# Altium schematic sheet REUN.468349.001_PSU_Board_12B_Interface.SchDoc
size 420 x 297 mm; DocumentNumber: РЕУН.468349.001 Э3 2D; SheetNumber: 7; Format: A3
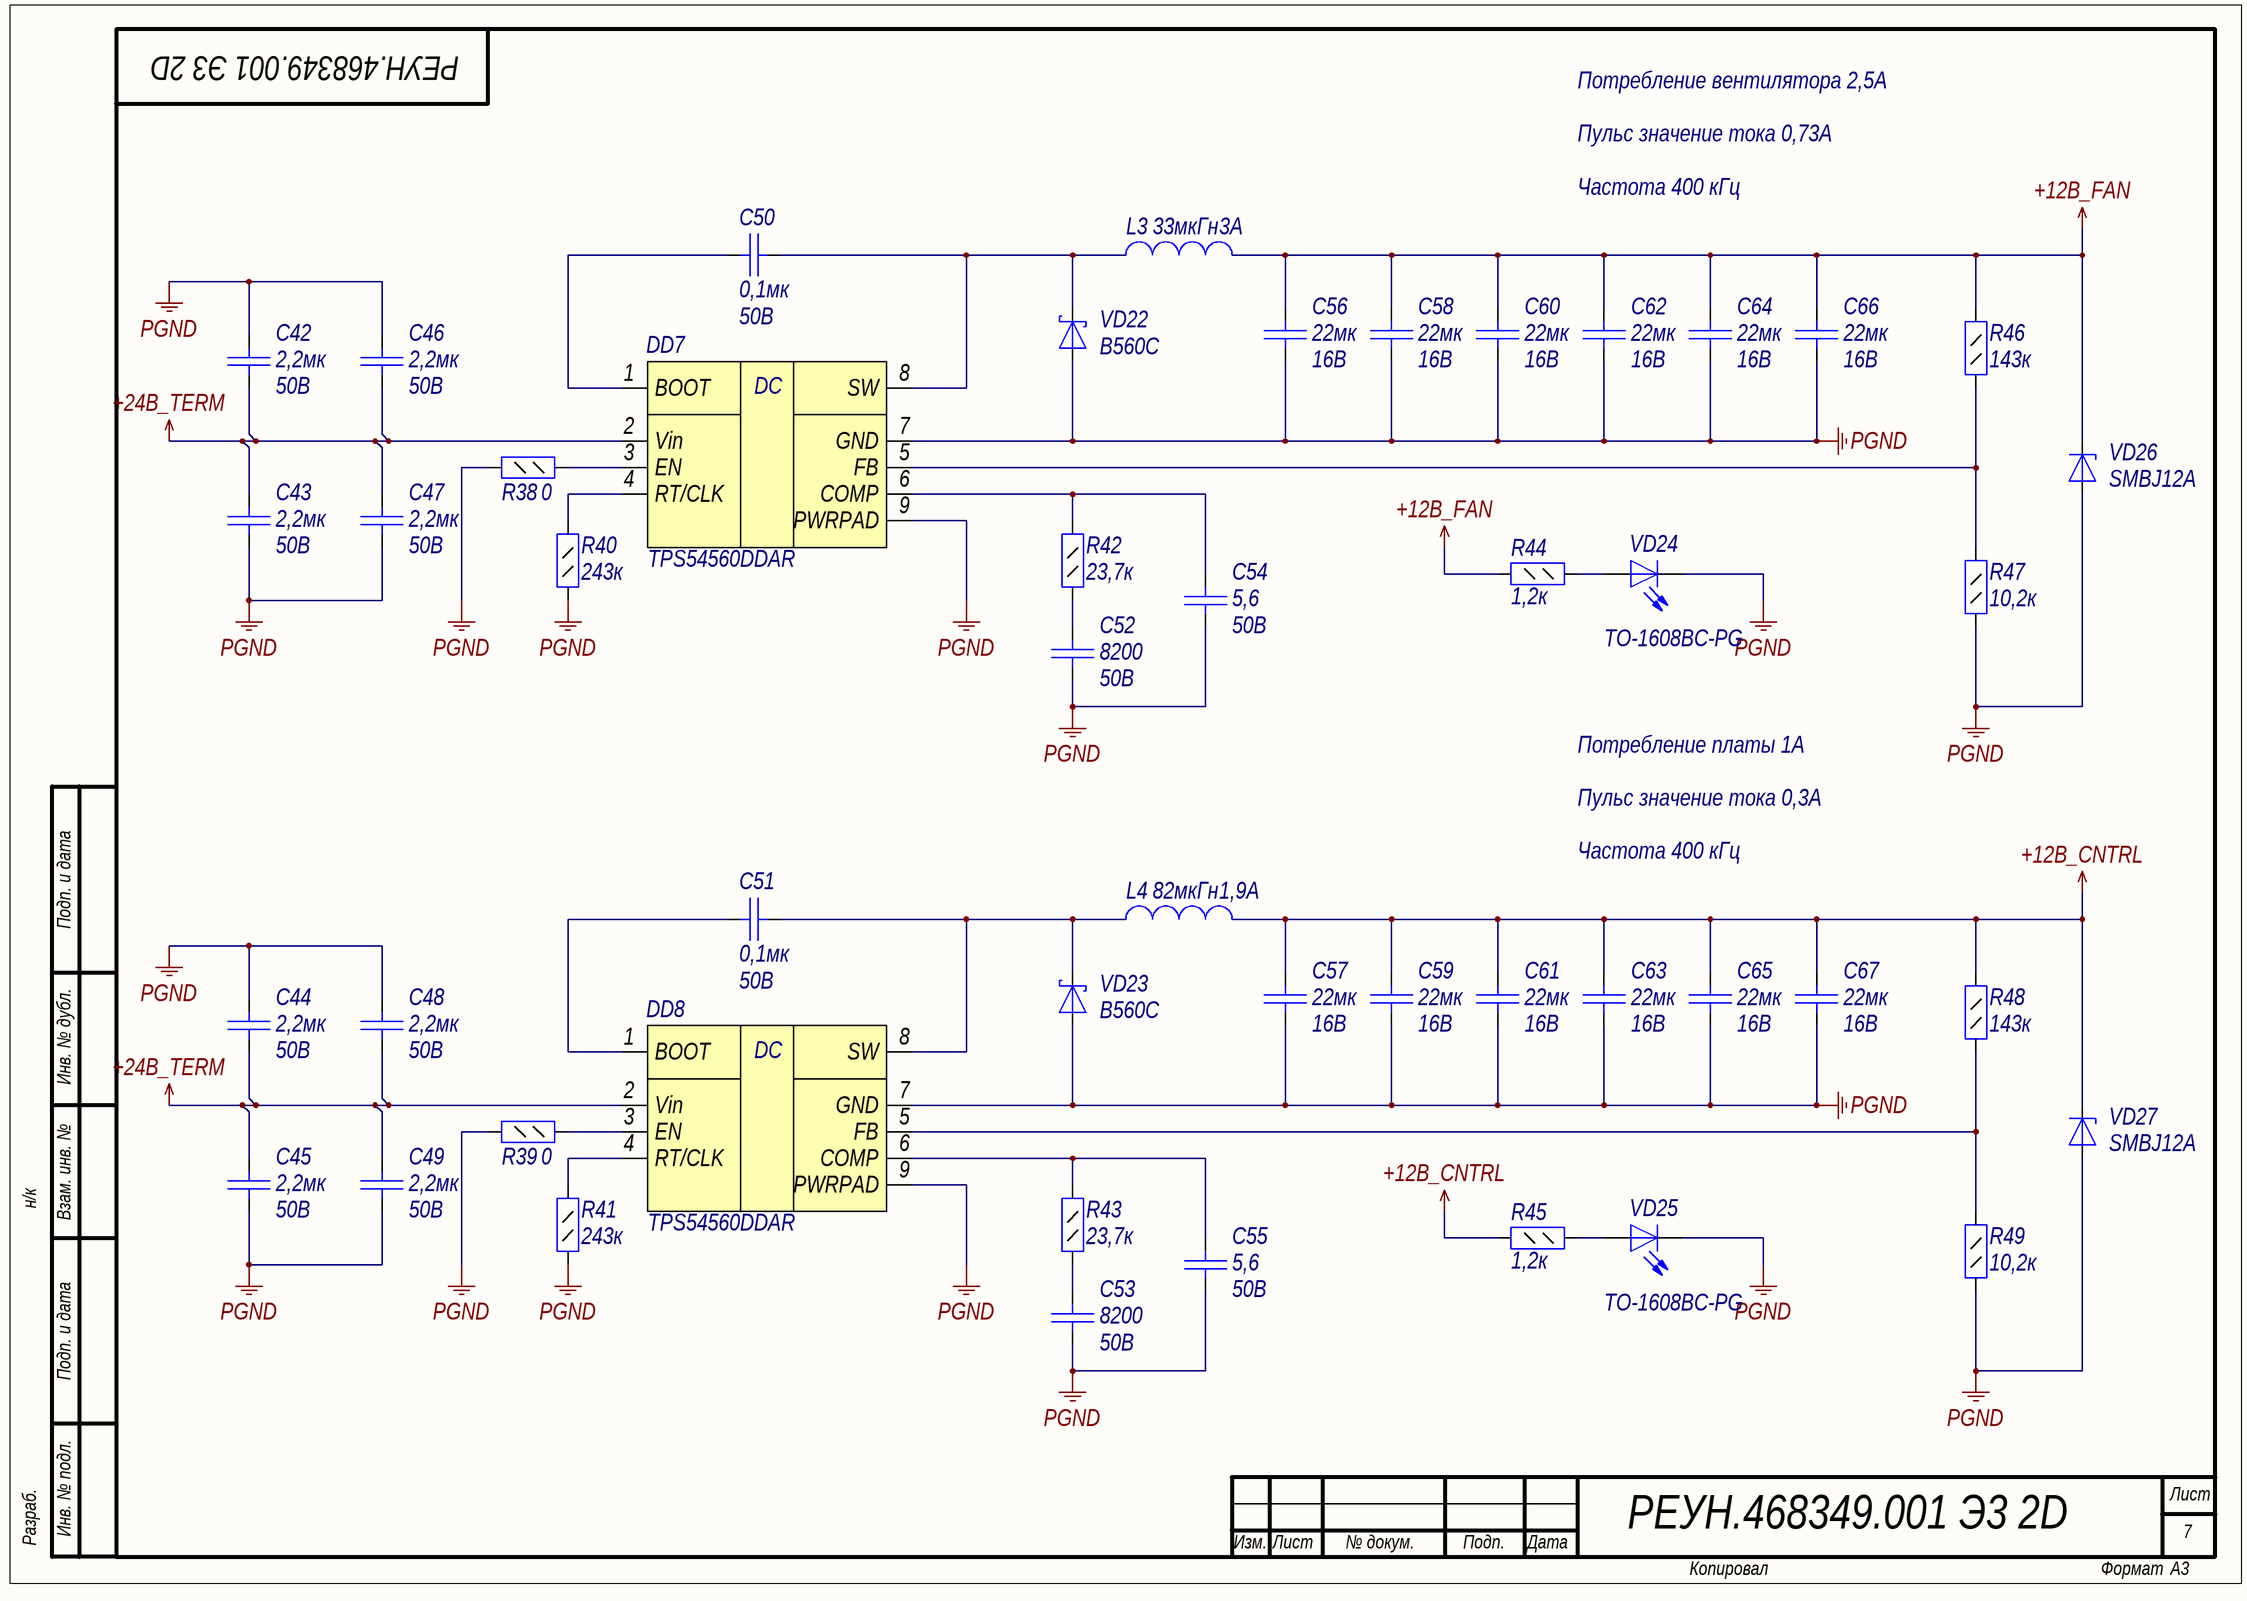
[diagram p0: REUN.468349.001_PSU_Board_12B_Interface.SchDoc]

## Parts
C42  Voltage: 50B  [C1206]  (hidden comment: 2,2мк)
C43  Voltage: 50B  [C1206]  (hidden comment: 2,2мк)
C44  Voltage: 50B  [C1206]  (hidden comment: 2,2мк)
C45  Voltage: 50B  [C1206]  (hidden comment: 2,2мк)
C46  Voltage: 50B  [C1206]  (hidden comment: 2,2мк)
C47  Voltage: 50B  [C1206]  (hidden comment: 2,2мк)
C48  Voltage: 50B  [C1206]  (hidden comment: 2,2мк)
C49  Voltage: 50B  [C1206]  (hidden comment: 2,2мк)
C50  Voltage: 50B  [C0805]  (hidden comment: 0,1мк)
C51  Voltage: 50B  [C0805]  (hidden comment: 0,1мк)
C52  Voltage: 50В  [C0805]  (hidden comment: 8200)
C53  Voltage: 50В  [C0805]  (hidden comment: 8200)
C54  Voltage: 50B  [C0805]  (hidden comment: 5,6)
C55  Voltage: 50B  [C0805]  (hidden comment: 5,6)
C56  Voltage: 16B  [C1210]  (hidden comment: 22мк)
C57  Voltage: 16B  [C1210]  (hidden comment: 22мк)
C58  Voltage: 16B  [C1210]  (hidden comment: 22мк)
C59  Voltage: 16B  [C1210]  (hidden comment: 22мк)
C60  Voltage: 16B  [C1210]  (hidden comment: 22мк)
C61  Voltage: 16B  [C1210]  (hidden comment: 22мк)
C62  Voltage: 16B  [C1210]  (hidden comment: 22мк)
C63  Voltage: 16B  [C1210]  (hidden comment: 22мк)
C64  Voltage: 16B  [C1210]  (hidden comment: 22мк)
C65  Voltage: 16B  [C1210]  (hidden comment: 22мк)
C66  Voltage: 16B  [C1210]  (hidden comment: 22мк)
C67  Voltage: 16B  [C1210]  (hidden comment: 22мк)
DD7  TPS54560DDAR  [SO Powerpad8]
DD8  TPS54560DDAR  [SO Powerpad8]
L3  value 33мкГн  Rated Current: 3A  [IND_12.5x12.5]  (hidden comment: Inductor)
L4  value 82мкГн  Rated Current: 1,9A  [IND_12.5x12.5]  (hidden comment: Inductor)
R38  value 0  [R0805]  (hidden comment: Resistor_0,125Вт)
R39  value 0  [R0805]  (hidden comment: Resistor_0,125Вт)
R40  value 243к  [R0805]  (hidden comment: Resistor_0,125Вт)
R41  value 243к  [R0805]  (hidden comment: Resistor_0,125Вт)
R42  value 23,7к  [R0805]  (hidden comment: Resistor_0,125Вт)
R43  value 23,7к  [R0805]  (hidden comment: Resistor_0,125Вт)
R44  value 1,2к  [R0805]  (hidden comment: Resistor_0,125Вт)
R45  value 1,2к  [R0805]  (hidden comment: Resistor_0,125Вт)
R46  value 143к  [R0805]  (hidden comment: Resistor_0,125Вт)
R47  value 10,2к  [R0805]  (hidden comment: Resistor_0,125Вт)
R48  value 143к  [R0805]  (hidden comment: Resistor_0,125Вт)
R49  value 10,2к  [R0805]  (hidden comment: Resistor_0,125Вт)
VD22  B560C  [SMC]
VD23  B560C  [SMC]
VD24  TO-1608BC-PG  [L_0603_GREEN]
VD25  TO-1608BC-PG  [L_0603_GREEN]
VD26  SMBJ12A  [SMB]
VD27  SMBJ12A  [SMB]

## Nets
+12B_CNTRL: C57.2 C59.2 C61.2 C63.2 C65.2 C67.2 L4.2 R45.2 R48.2 VD27.1(K)
+12B_FAN: C56.2 C58.2 C60.2 C62.2 C64.2 C66.2 L3.2 R44.2 R46.2 VD26.1(K)
+24B_TERM: C42.1 C43.2 C44.1 C45.2 C46.1 C47.2 C48.1 C49.2 DD7.2(Vin) DD8.2(Vin)
PGND: C42.2 C43.1 C44.2 C45.1 C46.2 C47.1 C48.2 C49.1 C52.1 C53.1 C54.1 C55.1 C56.1 C57.1 C58.1 C59.1 C60.1 C61.1 C62.1 C63.1 C64.1 C65.1 C66.1 C67.1 DD7.7(GND) DD7.9(PWRPAD) DD8.7(GND) DD8.9(PWRPAD) R38.2 R39.2 R40.1 R41.1 R47.1 R49.1 VD22.2(A) VD23.2(A) VD24.1(K) VD25.1(K) VD26.2(A) VD27.2(A)
NetC50_1: C50.1 DD7.8(SW) L3.1 VD22.1(K)
NetC50_2: C50.2 DD7.1(BOOT)
NetC51_1: C51.1 DD8.8(SW) L4.1 VD23.1(K)
NetC51_2: C51.2 DD8.1(BOOT)
NetC52_2: C52.2 R42.1
NetC53_2: C53.2 R43.1
NetC54_2: C54.2 DD7.6(COMP) R42.2
NetC55_2: C55.2 DD8.6(COMP) R43.2
NetDD7_3: DD7.3(EN) R38.1
NetDD7_4: DD7.4(RT/CLK) R40.2
NetDD7_5: DD7.5(FB) R46.1 R47.2
NetDD8_3: DD8.3(EN) R39.1
NetDD8_4: DD8.4(RT/CLK) R41.2
NetDD8_5: DD8.5(FB) R48.1 R49.2
NetR44_1: R44.1 VD24.2(A)
NetR45_1: R45.1 VD25.2(A)

## Notes on the sheet
- Потребление вентилятора 2,5А
- Пульс значение тока 0,73А
- Частота 400 кГц
- Потребление платы 1А
- Пульс значение тока 0,3А
- Подп. и дата
- Инв. № дубл.
- н/к
- Взам. инв. №
- Разраб.
- Инв. № подл.
- Лист
- Изм.
- № докум.
- Подп.
- Дата
- Копировал
- Формат
- (in symbol pwr177) DC

## Library data of the parts
C42-C49 = cap351: Конденсатор; Part Name: MLCC; Manufacture: Samsung; Part Number: CL31B225KBHNNNE; id: cap351; TKE: X7R; tga: 0.10%; Value: 2,2мк
C50 C51 = cap141: Конденсатор; Part Name: Ceramic; Manufacture: Murata; Part Number: GRM21BR71H104KA01K; id: cap141; TKE: X7R; Value: 0,1мк
C52 C53 = cap171: Конденсатор; Part Name: Ceramic; Manufacture: Murata; Part Number: GRM216R71H822KA01D; id: cap171; TKE: X7R; Value: 8200
C54 C55 = cap355: Конденсатор; Part Name: Ceramic; Manufacture: Samsung; Part Number: CL21C5R6CBANNNC; id: cap355; TKE: NP0; tga: 0.05%; Value: 5,6
C56-C67 = cap352: Конденсатор; Part Name: MLCC; Manufacture: Samsung; Part Number: CL32B226KOJNNNE; id: cap352; TKE: X7R; tga: 0.10%; Value: 22мк
DD7 DD8 = pwr177: 5-A, Wide Input Range, Step-Down Converter; Part Name: Step Down DC-DC Converter with Eco-mode; Manufacturer: Texas Instruments; id: pwr177; Input Voltage: 4,5-60В; Output Voltage: 0,8B-58,8B; Current: 5A; Frequency: 100 kHz-25 MHz; Type: Impulse; Part Number: TPS54560DDAR
L3 = ind80: EMI Suppression Filter; Part Name: SMD Power Inductors; Part Number: B82477G4333M000; Manufacture: Epcos; id: ind80; Saturation Current: 3,5A; Resistance: 0,053Ohm
L4 = ind83: EMI Suppression Filter; Part Name: SMD Power Inductors; Part Number: B82477G4823M000; Manufacture: Epcos; id: ind83; Saturation Current: 2,25A; Resistance: 0,145Ohm
R38 R39 = res25: Резистор; Manufacture: Yageo; Part Number: RC0805FR-070RL; id: res49; Accuracy: 0.01; Part Name: Resistor; Power: 0,125Вт
R40 R41 = res1226: Резистор; Manufacture: Yageo; Part Number: RC0805FR-07243KL; Accuracy: 0.01; id: res1226; Part Name: Resistor; Power: 0,125Вт
R42 R43 = res1173: Резистор; Manufacture: Yageo; Part Number: RC0805FR-0723K7L; Accuracy: 0.01; id: res1173; Part Name: Resistor; Power: 0,125Вт
R44 R45 = res78: Резистор; Manufacture: Yageo; Part Number: RC0805FR-071K2; id: res78; Accuracy: 0.01; Part Name: Resistor; Power: 0,125Вт
R46 R48 = res1253: Резистор; Manufacture: Yageo; Part Number: RC0805FR-07143KL; Accuracy: 0.01; id: res1253; Part Name: Resistor; Power: 0,125Вт
R47 R49 = res1230: Резистор; Manufacture: Yageo; Part Number: RC0805FR-0710K2L; Accuracy: 0.01; id: res1230; Part Name: Resistor; Power: 0,125Вт
VD22 VD23 = diode32: Диод Шоттки; Part Name: SCHOTTKY BARRIER RECTIFIER; Manufacture: Diodes Incorporated; Max Reverse Voltage: 60B; Forward Voltage: 0,7B; Forward Current: 5A; Reverse Current: 20mA; Capacitance: 300pF; Number: 1; id: diode32; Temp MAX: +150; Temp MIN: -55; Part Number: B560C
VD24 VD25 = diode43: Светодиод; Part Name: LED green 0603; Manufacture: OASISTEK; id: diode43; Part Number: TO-1608BC-PG
VD26 VD27 = SMBJ12A: Cтабилитрон (лавинный выпрямительный диод) односторонний; Part Name: TVS diode Unidirectional; Manufacture: ST Microelectronics; id: tvs73; Leakage Current: 0,2uA; Stand-off Voltage: 12B; Breakdown Voltage: 14B; Clamping voltage: 19,9B; Dynamic resistance: 0,168Ohm; Peak Pulse Power: 600W; Number of diodes: 1; Part Number: SMBJ12A